# Altium schematic sheet VUE_PIC32_v1_0_Analog_4X.SchDoc: [VUE32 - 4 ch. analog inputs]
size A4; Engineer: JFDuval; Revision: 1.0
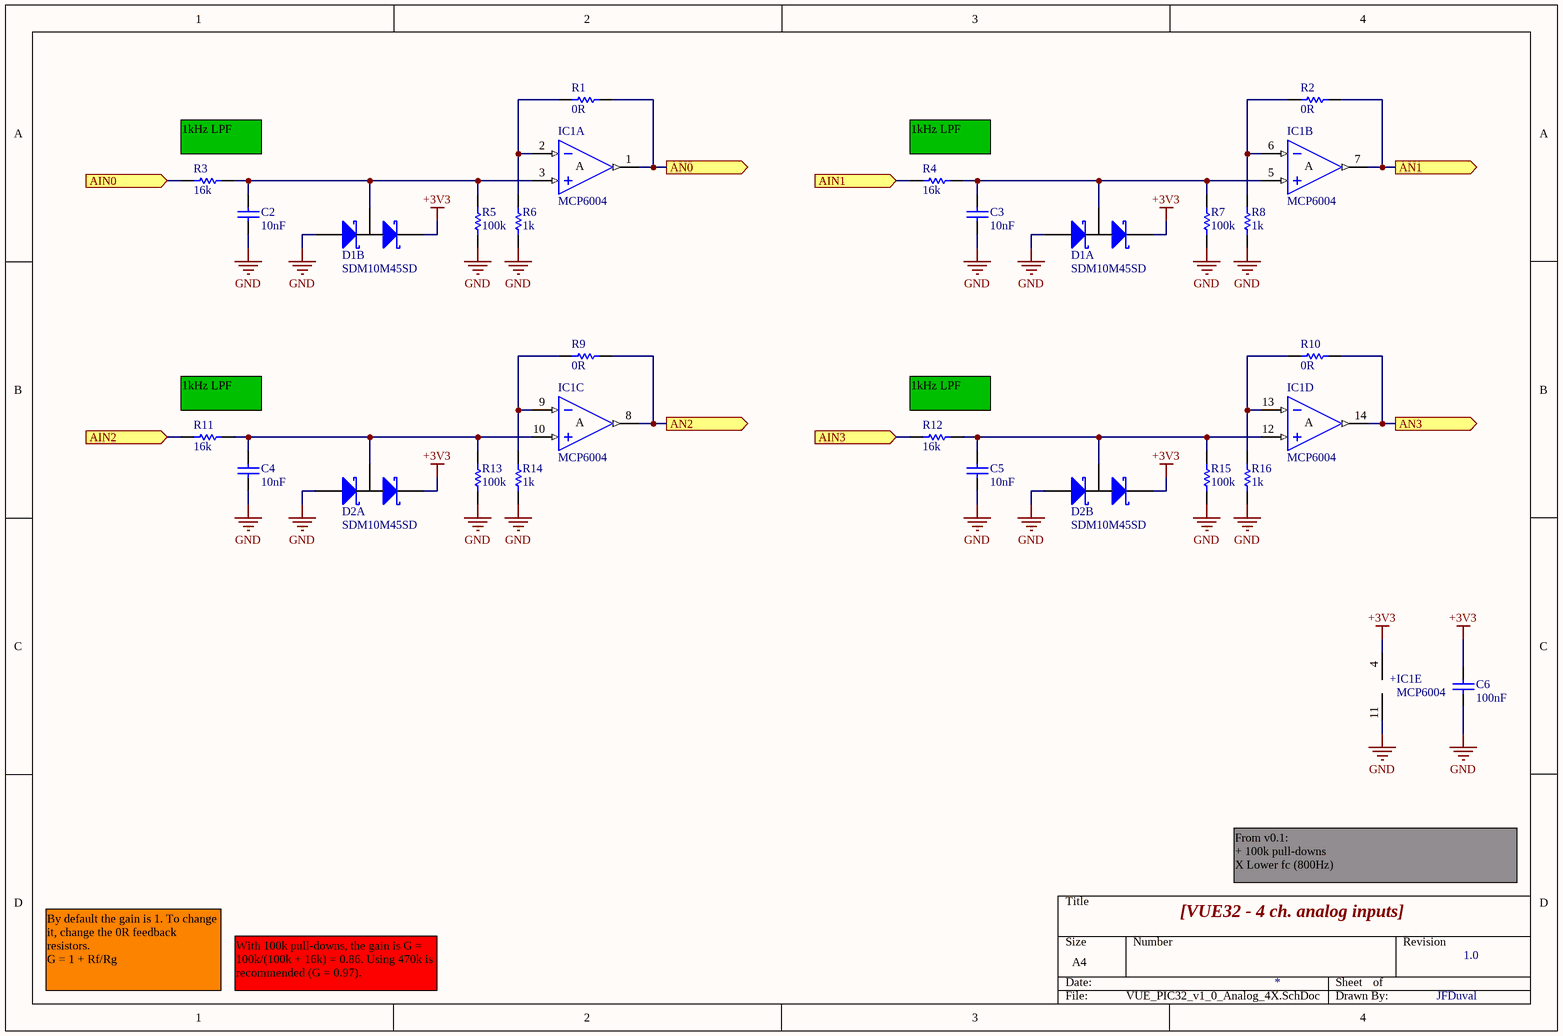
[diagram p0: VUE_PIC32_v1_0_Analog_4X.SchDoc]

## Parts
C2  10nF  [0402C]
C3  10nF  [0402C]
C4  10nF  [0402C]
C5  10nF  [0402C]
C6  100nF  [0402C]
D1  SDM10M45SD  [SOT23-6]  (parts A,B of 2)
D2  SDM10M45SD  [SOT23-6]  (parts A,B of 2)
IC1  MCP6004  [TSSOP14]  (parts A,B,C,D,E of 5)
R1  0R  [0402]
R2  0R  [0402]
R3  16k  [0402]
R4  16k  [0402]
R5  100k  [0402]
R6  value 1k  [0402]  (hidden comment: DNS)
R7  100k  [0402]
R8  value 1k  [0402]  (hidden comment: DNS)
R9  0R  [0402]
R10  0R  [0402]
R11  16k  [0402]
R12  16k  [0402]
R13  100k  [0402]
R14  value 1k  [0402]  (hidden comment: DNS)
R15  100k  [0402]
R16  value 1k  [0402]  (hidden comment: DNS)

## Ports
AIN0 (in), AIN1 (in), AIN2 (in), AIN3 (in), AN0 (out), AN1 (out), AN2 (out), AN3 (out)

## Nets
+3V3: C6.2 D1.2(K) D1.5(K) D2.2(K) D2.5(K) IC1.4(VDD)
GND: C2.1 C3.1 C4.1 C5.1 C6.1 D1.1(A) D1.4(A) D2.1(A) D2.4(A) IC1.11(VSS) R5.1 R6.1 R7.1 R8.1 R13.1 R14.1 R15.1 R16.1
AIN0: R3.1 ; port AIN0
AIN1: R4.1 ; port AIN1
AIN2: R11.1 ; port AIN2
AIN3: R12.1 ; port AIN3
AN0: IC1.1(OUT) R1.1 ; port AN0
AN1: IC1.7(OUT) R2.1 ; port AN1
AN2: IC1.8(OUT) R9.1 ; port AN2
AN3: IC1.14(OUT) R10.1 ; port AN3
NetC2_2: C2.2 D1.3(M) IC1.3(IN+) R3.2 R5.2
NetC3_2: C3.2 D1.6(M) IC1.5(IN+) R4.2 R7.2
NetC4_2: C4.2 D2.6(M) IC1.10(IN+) R11.2 R13.2
NetC5_2: C5.2 D2.3(M) IC1.12(IN+) R12.2 R15.2
NetIC1_2: IC1.2(IN-) R1.2 R6.2
NetIC1_6: IC1.6(IN-) R2.2 R8.2
NetIC1_9: IC1.9(IN-) R9.2 R14.2
NetIC1_13: IC1.13(IN-) R10.2 R16.2

## Notes on the sheet
- (near R3) 1kHz LPF
- (near R4) 1kHz LPF
- (near R11) 1kHz LPF
- (near R12) 1kHz LPF
- From v0.1:
  + 100k pull-downs
  X Lower fc (800Hz)
- By default the gain is 1. To change it, change the 0R feedback resistors.
  G = 1 + Rf/Rg
- With 100k pull-downs, the gain is G = 100k/(100k + 16k) = 0.86. Using 470k is recommended (G = 0.97).
- (in symbol IC_OPA_MICROCHIP_MCP6004_QUAD_TSSOP14, part A) A
- (in symbol IC_OPA_MICROCHIP_MCP6004_QUAD_TSSOP14, part B) A
- (in symbol IC_OPA_MICROCHIP_MCP6004_QUAD_TSSOP14, part C) A
- (in symbol IC_OPA_MICROCHIP_MCP6004_QUAD_TSSOP14, part D) A
- (in symbol IC_OPA_MICROCHIP_MCP6004_QUAD_TSSOP14, part E) +

## Library data of the parts
C2-C5 = CAP_TDK_C_0402_10nF_25V: CAP CER 10000PF 25V 10% X7R 0402; MfgPartNumber: C1005X7R1E103K; Mfg: TDK; Value: 10nF; Digikey: 445-1260-1-ND
C6 = CAP_TDK_C_0402_100nF_25V: CAP CER 0.1UF 25V Y5V 0402; MfgPartNumber: C1005Y5V1E104Z; Mfg: TDK; Value: 100nF; Digikey: 445-3445-1-ND
D1 D2 = DIODE_DIODESINC_SDM10M45SD_QUAD_SCHOTTKY_45V_200MA: DIODE SCHOTTKY ARRAY 45V SOT26; MfgPartNumber: SDM10M45SD-7-F; Mfg: Diodes Inc; Digikey: SDM10M45SD-FDICT-ND; Value: SDM10M45SD
IC1 = IC_OPA_MICROCHIP_MCP6004_QUAD_TSSOP14: IC OPAMP QUAD 1.8V 14TSSOP; MfgPartNumber: MCP6004-I/ST; Mfg: Microchip Technology; Value: MCP6004; Digikey: MCP6004-I/ST-ND
R1 R2 R9 R10 = RES_YAGEO_0402_0R_1PCT: RES 0.0 OHM 1/16W 0402 SMD; MfgPartNumber: RC0402JR-070RL; Mfg: Yageo; Value: 0R; Digikey: 311-0.0JRCT-ND
R3 R4 R11 R12 = RES_YAGEO_0402_16K_1PCT: RES 16.0K OHM 1/16W 1% 0402 SMD; MfgPartNumber: RC0402FR-0716KL; Mfg: Yageo; Value: 16k; Digikey: 311-16.0KLRCT-ND
R5 R7 R13 R15 = RES_YAGEO_0402_100K_1PCT: RES 100K OHM 1/16W 1% 0402 SMD; MfgPartNumber: RC0402FR-07100KL; Mfg: Yageo; Digikey: 311-100KLRCT-ND; Value: 100k
R6 R8 R14 R16 = RES_YAGEO_0402_1K_1PCT: RES 1.00K OHM 1/16W 1% 0402 SMD; MfgPartNumber: RC0402FR-071KL; Mfg: Yageo; Digikey: 311-1.00KLRCT-ND